# Altium schematic sheet BatteryCharge.SchDoc
size A4
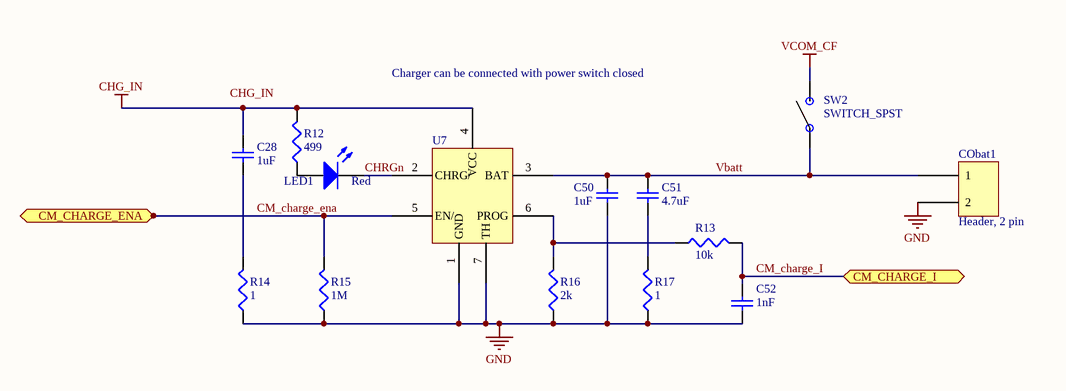
[diagram p0: BatteryCharge.SchDoc]

## Parts
C28  value 1uF  [0402]  (hidden comment: C1005X5R1C105M050BC)
C50  value 1uF  [0402]  (hidden comment: C1005X5R1C105M050BC)
C51  value 4.7uF  [0402]  (hidden comment: GRM188R6YA475KE15D)
C52  value 1nF  [0402]  (hidden comment: GRM155R61H102KA01D)
CObat1  Header, 2 pin  [Pin Header, 1x2, TH]
LED1  Color: Red  [0603]
R12  value 499  [0402]  (hidden comment: ERJ-2RKF4990X)
R13  value 10k  [0402]  (hidden comment: ERJ-2RKF1002X)
R14  value 1  [0402]  (hidden comment: ERJ-2BQF1R0X)
R15  value 1M  [0402]  (hidden comment: ERJ-2RKF1004X)
R16  value 2k  [0402]  (hidden comment: ERJ-2RKF2001X)
R17  value 1  [0402]  (hidden comment: ERJ-2BQF1R0X)
SW2  SWITCH_SPST  [SWITCH_SPST_CHS-01TB]
U7  LTC4065EDC#TRMPBF  [DFN-6_LT]  (value not drawn)

## Ports
CM_CHARGE_ENA (bidir), CM_CHARGE_I (bidir)

## Nets
CHG_IN: C28.2 R12.2 U7.4(VCC)
GND: C50.1 C52.1 CObat1.2 R14.1 R15.1 R16.1 R17.1 U7.1(GND) U7.7(TH)
VCOM_CF: SW2.1
CHRGn: LED1.2(K) U7.2(CHRG/)
CM_charge_ena: R15.2 U7.5(EN/) ; port CM_CHARGE_ENA
CM_charge_I: C52.2 R13.2 ; port CM_CHARGE_I
Vbatt: C50.2 C51.2 CObat1.1 SW2.2 U7.3(BAT)
NetC28_1: C28.1 R14.2
NetC51_1: C51.1 R17.2
NetLED1_1: LED1.1(A) R12.1
NetR13_1: R13.1 R16.2 U7.6(PROG)

## Notes on the sheet
- Charger can be connected with power switch closed
- Labels drawn without touching a wire or pin: CHG_IN

## Library data of the parts
C28 C50 = Cap: CAP CER 1UF 16V X5R 0402; Manufacturer: TDK; Supplier: Digikey; Supplier PN: 445-9073-1-ND; Manufacturer PN: C1005X5R1C105M050BC
C51 = Cap: CAP CER 4.7UF 35V X5R 0603; Manufacturer: Murata; Supplier: Digikey; Supplier PN: 490-7205-1-ND; Manufacturer PN: GRM188R6YA475KE15D
C52 = Cap: CAP CER 1000PF 50V X5R 0402; Manufacturer: Murata; Supplier: Digikey; Supplier PN: 490-6316-1-ND; Manufacturer PN: GRM155R61H102KA01D
CObat1 = Header, 2 pin: Header 1x2; Manufacturer: Samtec; Manufacturer PN: TMM-102-03-T-S; Supplier: Digikey; Supplier PN: SAM8977-ND
LED1 = LED: LED RED CLEAR 0603 SMD; Manufacturer: Rohm; Manufacturer PN: SML-311UTT86; Supplier: Digikey; Supplier PN: 511-1304-1-ND
R12 = Resistor: RES SMD 499 OHM 1% 1/10W 0402; Manufacturer: Panasonic; Manufacturer PN: ERJ-2RKF4990X; Supplier: Digikey; Supplier P/N: P499LCT-ND; Power: 1/10W; Package: 0402
R13 = Resistor: RES SMD 10K OHM 1% 1/10W 0402; Manufacturer: Panasonic; Manufacturer PN: ERJ-2RKF1002X; Supplier: Digikey; Supplier P/N: P10.0KLCT-ND; Power: 1/10W; Package: 0402
R14 R17 = Resistor: RES SMD 1 OHM 1% 1/6W 0402; Manufacturer: Panasonic; Manufacturer PN: ERJ-2BQF1R0X; Supplier: Digikey; Supplier P/N: P17252CT-ND; Power: 1/6W; Package: 0402
R15 = Resistor: RES SMD 1M OHM 1% 1/10W 0402; Manufacturer: Panasonic; Manufacturer PN: ERJ-2RKF1004X; Supplier: Digikey; Supplier P/N: P1.00MLCT-ND; Power: 1/10W; Package: 0402
R16 = Resistor: RES SMD 2K OHM 1% 1/10W 0402; Manufacturer: Panasonic; Manufacturer PN: ERJ-2RKF2001X; Supplier: Digikey; Supplier P/N: P2.00KLCT-ND; Power: 1/10W; Package: 0402
SW2 = SWITCH_SPST: SWITCH SLIDE DIP SPST 100MA 6V; Manufacturer: Copal; Manufacturer PN: CHS-01TB; Supplier: Digikey; Supplier PN: 563-1004-1-ND
U7 = LTC4065EDC: IC CHARGER BATT LI-ON 6-DFN; Manufacturer: LT; Note: 4.4v float version is available (4.2 is standard): LTC4065EDC-4.4; Manufacturer PN: LTC4065EDC#TRMPBF; Supplier: Digikey; Supplier PN: LTC4065EDC#TRMPBFCT-ND